# EAGLE board proto4 (EAGLE 6.6.0), part 1 of 5
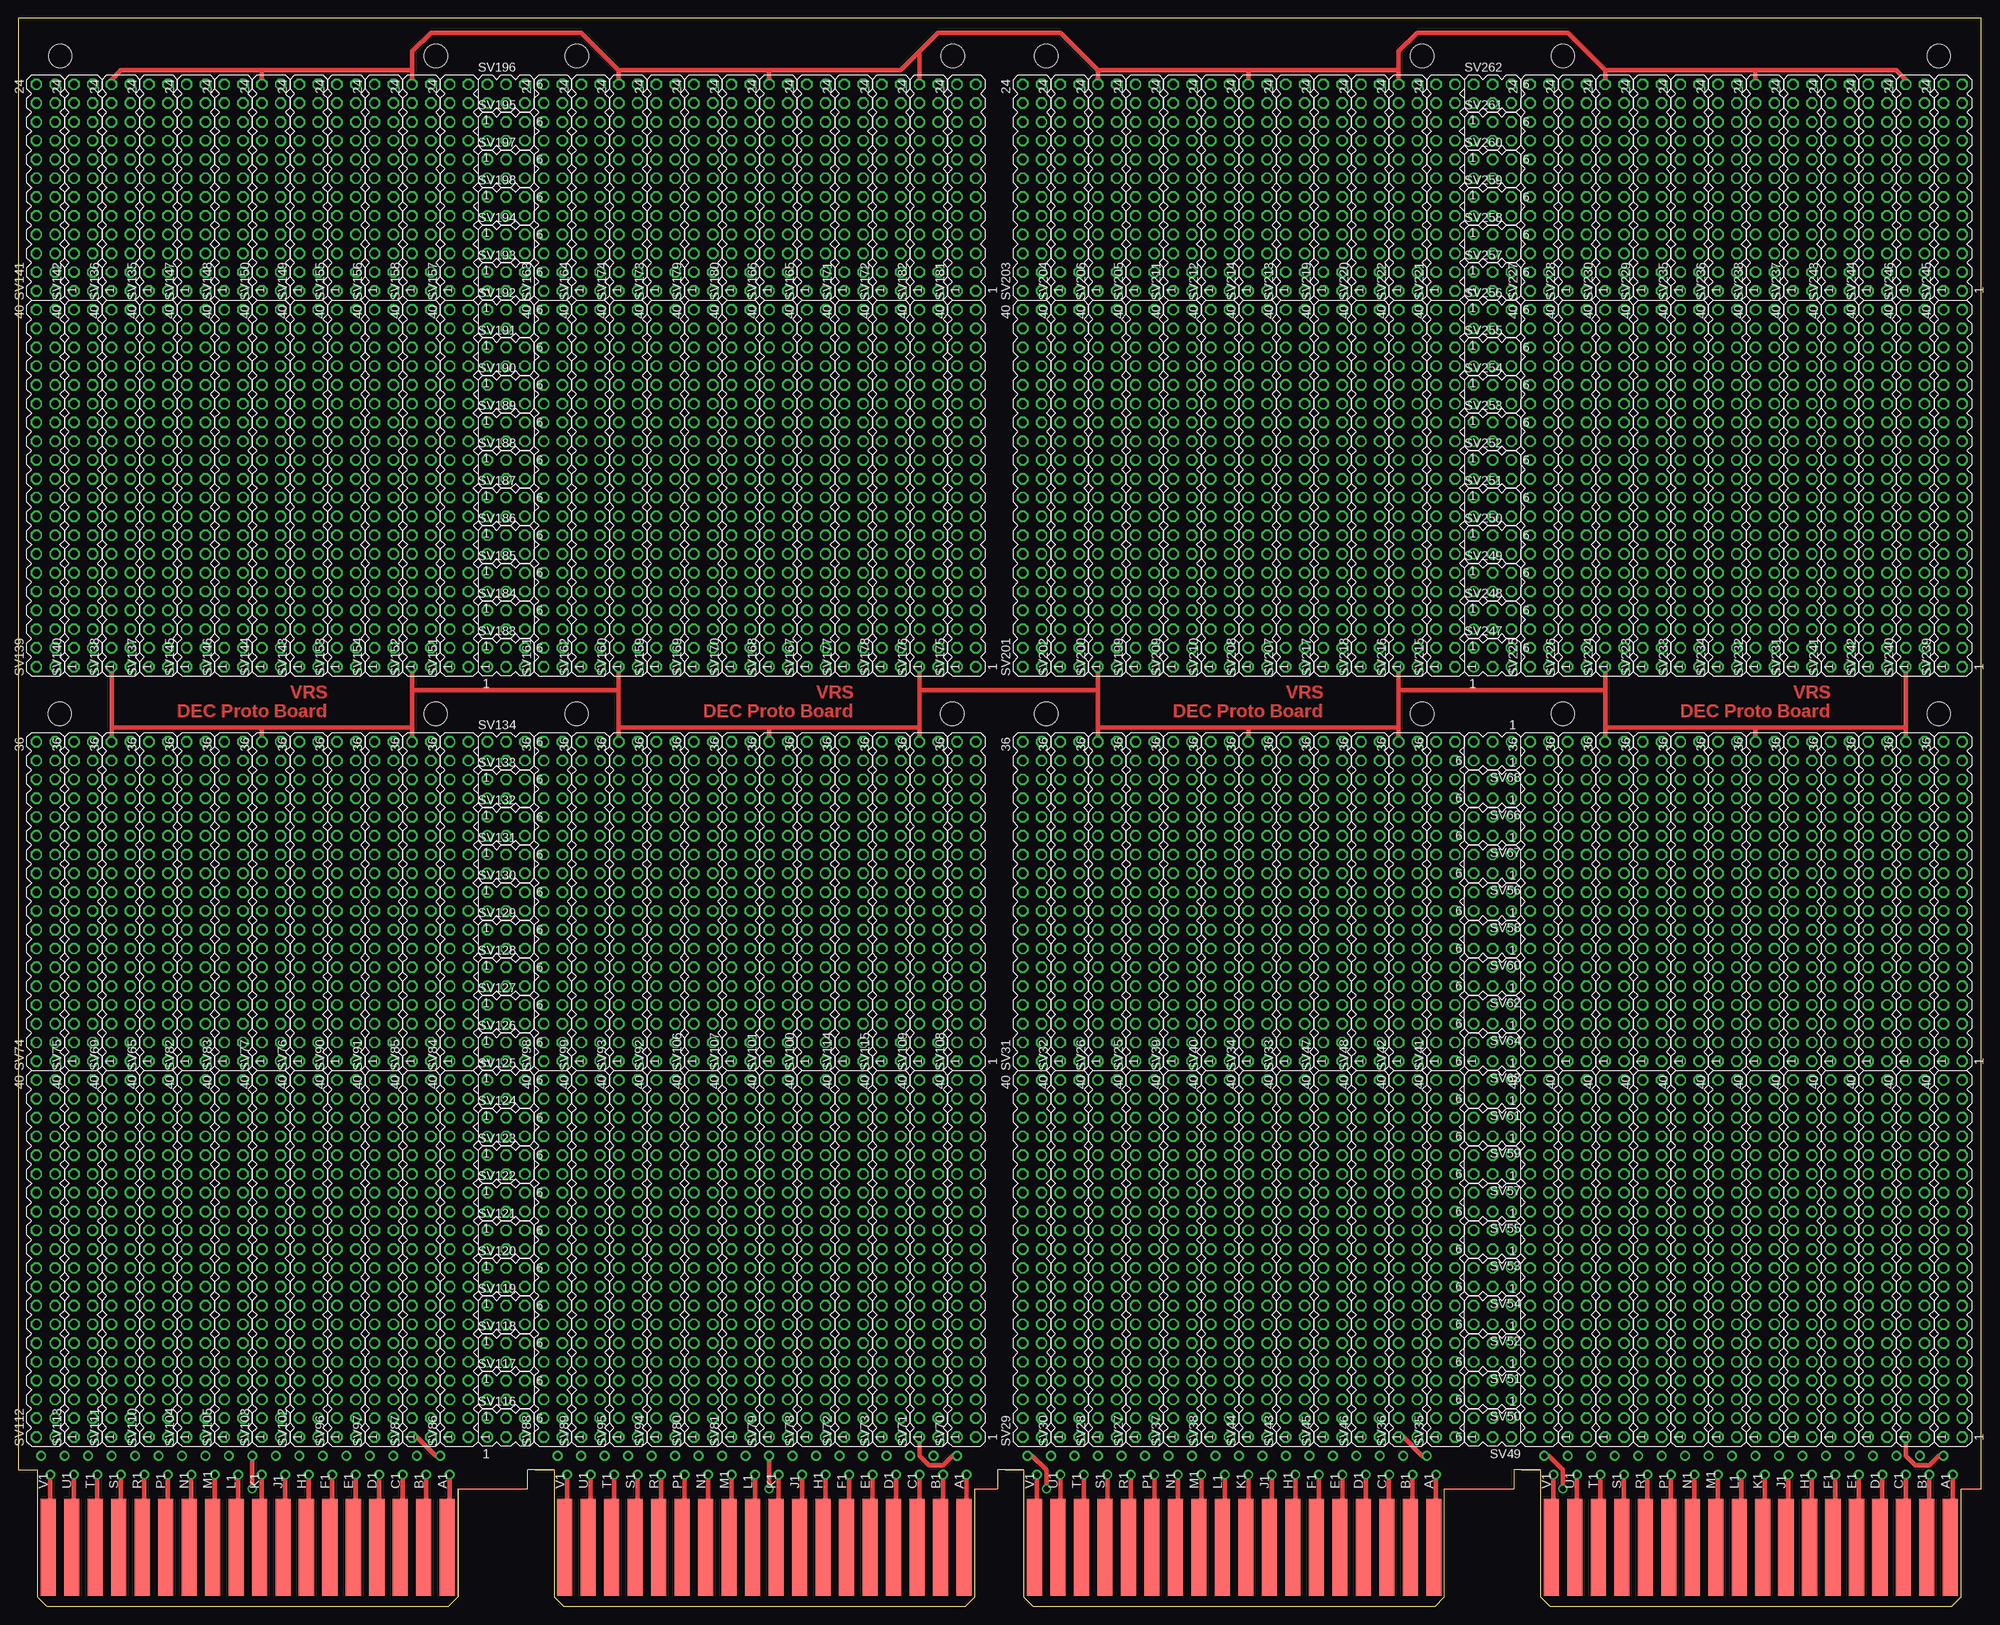
[diagram p5: board, top side]
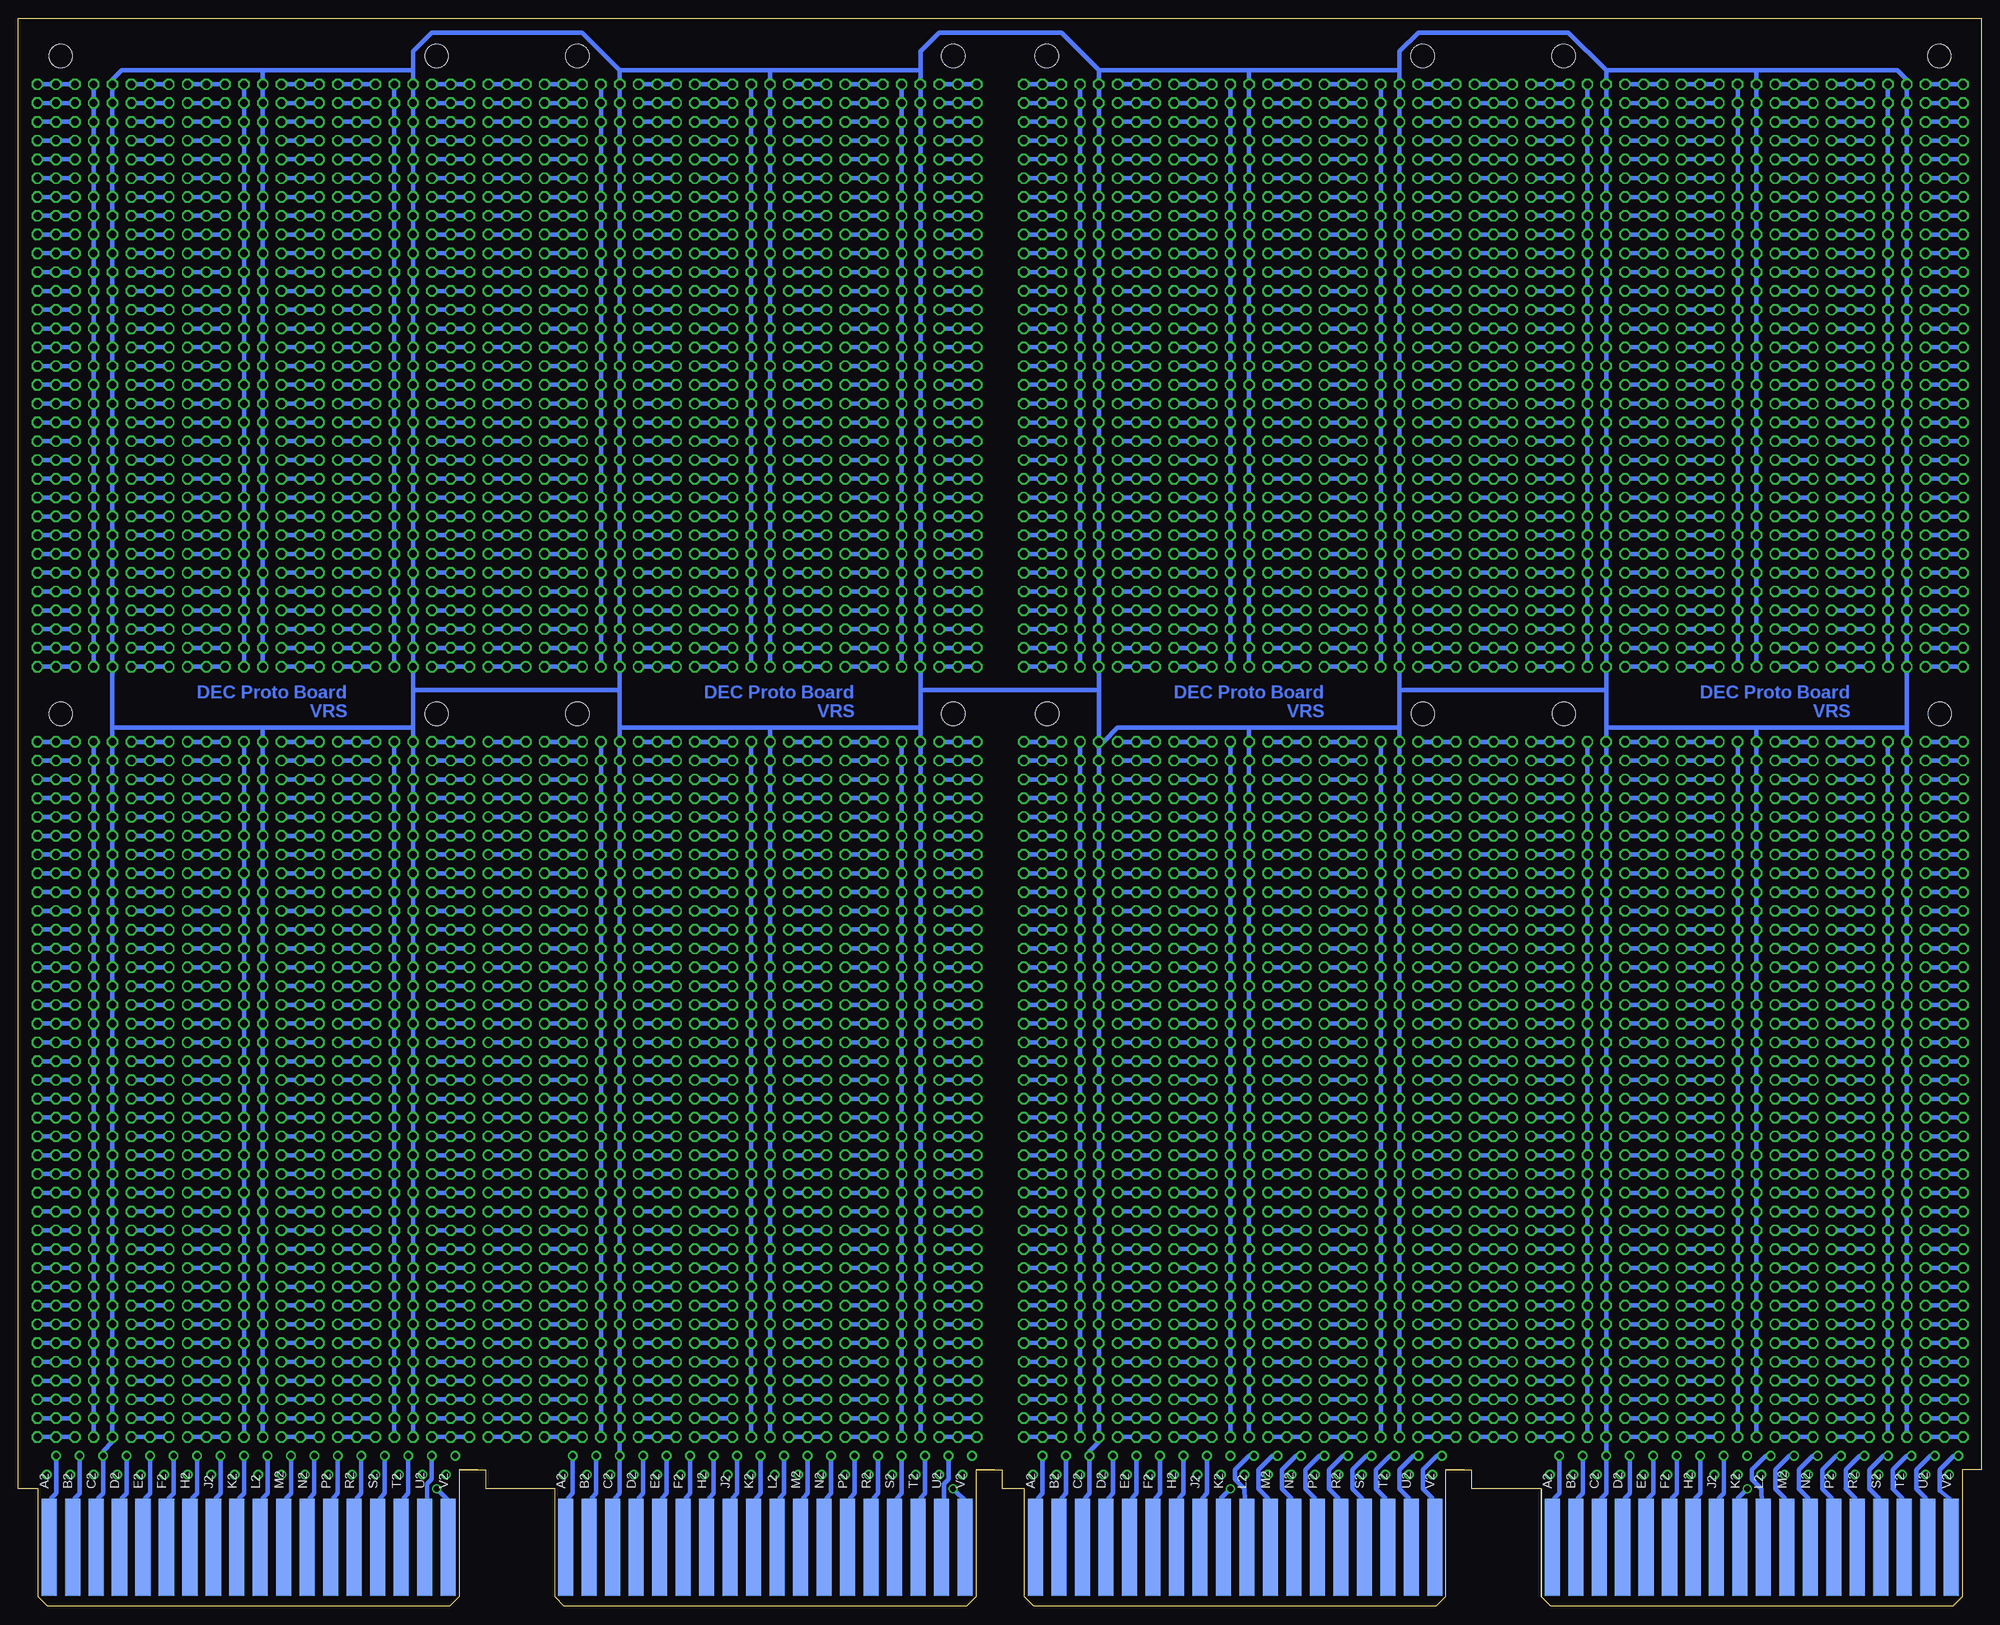
[diagram p6: board, bottom side, seen from below]

Size 265.3 x 214.63 mm. Coordinates in mm from the lower left corner, seen from the top.
Copper layers (1+16): Top 0.035mm / dielectric 1.5mm / Bottom 0.035mm
Design rules "16mils": minimum track width 16mil, minimum drill 32mil, track to track 15mil, track to pad 10mil, pad to pad 10mil, via to via 10mil, smd to smd 10mil, copper to edge 13mil, drill to drill 10mil, minimum pad ring 10mil, minimum via ring 8mil, stop-mask expansion 0mil, vias tented up to drill 0mil, thermal gap 10mil
Net classes: 0 default: width 0.635 mm
Holes 3.17 mm at 5.59,120.65 75.44,120.65 56.39,120.65 126.24,120.65 138.94,120.65 208.79,120.65 189.74,120.65 259.59,120.65

## Footprints (pad centres in the part's own frame; a part is rotated, then mirrored left to right if it is on the bottom)
EDGE-CON2 = smd 13.106 x 2.032: A1 7.938,4.128; B1 7.938,7.303; C1 7.938,10.477; D1 7.938,13.652; E1 7.938,16.828; F1 7.938,20.003; H1 7.938,23.177; J1 7.938,26.352; K1 7.938,29.527; L1 7.938,32.703; M1 7.938,35.877; N1 7.938,39.053; P1 7.938,42.227; R1 7.938,45.403; S1 7.938,48.578; T1 7.938,51.752; U1 7.938,54.928; V1 7.938,58.102 | smd 13.106 x 2.032 bottom: A2 7.938,4.128; B2 7.938,7.303; C2 7.938,10.477; D2 7.938,13.652; E2 7.938,16.828; F2 7.938,20.003; H2 7.938,23.177; J2 7.938,26.352; K2 7.938,29.527; L2 7.938,32.703; M2 7.938,35.877; N2 7.938,39.053; P2 7.938,42.227; R2 7.938,45.403; S2 7.938,48.578; T2 7.938,51.752; U2 7.938,54.928; V2 7.938,58.102
MA20-2 = drill 1.016 octagon: 1 -24.13,-1.27; 2 -24.13,1.27; 3 -21.59,-1.27; 4 -21.59,1.27; 5 -19.05,-1.27; 6 -19.05,1.27; 7 -16.51,-1.27; 8 -16.51,1.27; 9 -13.97,-1.27; 10 -13.97,1.27; 11 -11.43,-1.27; 12 -11.43,1.27; 13 -8.89,-1.27; 14 -8.89,1.27; 15 -6.35,-1.27; 16 -6.35,1.27; 17 -3.81,-1.27; 18 -3.81,1.27; 19 -1.27,-1.27; 20 -1.27,1.27; 21 1.27,-1.27; 22 1.27,1.27; 23 3.81,-1.27; 24 3.81,1.27; 25 6.35,-1.27; 26 6.35,1.27; 27 8.89,-1.27; 28 8.89,1.27; 29 11.43,-1.27; 30 11.43,1.27; 31 13.97,-1.27; 32 13.97,1.27; 33 16.51,-1.27; 34 16.51,1.27; 35 19.05,-1.27; 36 19.05,1.27; 37 21.59,-1.27; 38 21.59,1.27; 39 24.13,-1.27; 40 24.13,1.27
MA18-2 = drill 1.016 octagon: 1 -21.59,-1.27; 2 -21.59,1.27; 3 -19.05,-1.27; 4 -19.05,1.27; 5 -16.51,-1.27; 6 -16.51,1.27; 7 -13.97,-1.27; 8 -13.97,1.27; 9 -11.43,-1.27; 10 -11.43,1.27; 11 -8.89,-1.27; 12 -8.89,1.27; 13 -6.35,-1.27; 14 -6.35,1.27; 15 -3.81,-1.27; 16 -3.81,1.27; 17 -1.27,-1.27; 18 -1.27,1.27; 19 1.27,-1.27; 20 1.27,1.27; 21 3.81,-1.27; 22 3.81,1.27; 23 6.35,-1.27; 24 6.35,1.27; 25 8.89,-1.27; 26 8.89,1.27; 27 11.43,-1.27; 28 11.43,1.27; 29 13.97,-1.27; 30 13.97,1.27; 31 16.51,-1.27; 32 16.51,1.27; 33 19.05,-1.27; 34 19.05,1.27; 35 21.59,-1.27; 36 21.59,1.27
MA03-2 = drill 1.016: 1 -2.54,-1.27 | drill 1.016 octagon: 2 -2.54,1.27; 3 0,-1.27; 4 0,1.27; 5 2.54,-1.27; 6 2.54,1.27
MA12-2 = drill 1.016 octagon: 1 -13.97,-1.27; 2 -13.97,1.27; 3 -11.43,-1.27; 4 -11.43,1.27; 5 -8.89,-1.27; 6 -8.89,1.27; 7 -6.35,-1.27; 8 -6.35,1.27; 9 -3.81,-1.27; 10 -3.81,1.27; 11 -1.27,-1.27; 12 -1.27,1.27; 13 1.27,-1.27; 14 1.27,1.27; 15 3.81,-1.27; 16 3.81,1.27; 17 6.35,-1.27; 18 6.35,1.27; 19 8.89,-1.27; 20 8.89,1.27; 21 11.43,-1.27; 22 11.43,1.27; 23 13.97,-1.27; 24 13.97,1.27
THRU-HOLEA = drill 0.813 pad 1.27: A1 17.78,3.81; A2 20.32,5.08; B1 17.78,6.985; B2 20.32,8.255; C1 17.78,10.16; C2 20.32,11.43; D1 17.78,13.335; D2 20.32,14.605; E1 17.78,16.51; E2 20.32,17.78; F1 17.78,19.685; F2 20.32,20.955; H1 17.78,22.86; H2 20.32,24.13; J1 17.78,26.035; J2 20.32,27.305; K1 17.78,29.21; K2 20.32,30.48; L1 17.78,32.385; L2 20.32,33.655; M1 17.78,35.56; M2 20.32,36.83; N1 17.78,38.735; N2 20.32,40.005; P1 17.78,41.91; P2 20.32,43.18; R1 17.78,45.085; R2 20.32,46.355; S1 17.78,48.26; S2 20.32,49.53; T1 17.78,51.435; T2 20.32,52.705; U1 17.78,54.61; U2 20.32,55.88; V1 17.78,57.785; V2 20.32,59.055
OMNIBUS = hole 3.175: 208.915,209.55; 259.715,209.55; 189.865,209.55; 139.065,209.55; 75.616,209.55; 126.416,209.55; 56.566,209.55; 5.766,209.55

## Placement (x,y rotation side)
A  [EDGE-CON2]  265.3,0 90 top
A1  [EDGE-CON2]  131.95,0 90 top
B  [EDGE-CON2]  195.45,0 90 top
B1  [EDGE-CON2]  62.1,0 90 top
SV1  [MA20-2]  261.49,46.99 90 top
SV2  [MA20-2]  256.41,46.99 90 top
SV3  [MA20-2]  246.25,46.99 90 top
SV4  [MA20-2]  251.33,46.99 90 top
SV5  [MA18-2]  246.25,95.25 90 top
SV6  [MA18-2]  251.33,95.25 90 top
SV7  [MA18-2]  261.49,95.25 90 top
SV8  [MA18-2]  256.41,95.25 90 top
SV9  [MA18-2]  241.17,95.25 90 top
SV10  [MA18-2]  236.09,95.25 90 top
SV11  [MA20-2]  241.17,46.99 90 top
SV12  [MA20-2]  236.09,46.99 90 top
SV13  [MA20-2]  225.93,46.99 90 top
SV14  [MA20-2]  231.01,46.99 90 top
SV15  [MA18-2]  225.93,95.25 90 top
SV16  [MA18-2]  231.01,95.25 90 top
SV17  [MA18-2]  220.85,95.25 90 top
SV18  [MA18-2]  215.77,95.25 90 top
SV19  [MA20-2]  220.85,46.99 90 top
SV20  [MA20-2]  215.77,46.99 90 top
SV21  [MA20-2]  205.61,46.99 90 top
SV22  [MA20-2]  210.69,46.99 90 top
SV23  [MA18-2]  205.61,95.25 90 top
SV24  [MA18-2]  210.69,95.25 90 top
SV25  [MA18-2]  152.27,95.25 90 top
SV26  [MA18-2]  147.19,95.25 90 top
SV27  [MA20-2]  152.27,46.99 90 top
SV28  [MA20-2]  147.19,46.99 90 top
SV29  [MA20-2]  137.03,46.99 90 top
SV30  [MA20-2]  142.11,46.99 90 top
SV31  [MA18-2]  137.03,95.25 90 top
SV32  [MA18-2]  142.11,95.25 90 top
SV33  [MA18-2]  172.59,95.25 90 top
SV34  [MA18-2]  167.51,95.25 90 top
SV35  [MA20-2]  192.91,46.99 90 top
SV36  [MA20-2]  187.83,46.99 90 top
SV37  [MA20-2]  157.35,46.99 90 top
SV38  [MA20-2]  162.43,46.99 90 top
SV39  [MA18-2]  157.35,95.25 90 top
SV40  [MA18-2]  162.43,95.25 90 top
SV41  [MA18-2]  192.91,95.25 90 top
SV42  [MA18-2]  187.83,95.25 90 top
SV43  [MA20-2]  172.59,46.99 90 top
SV44  [MA20-2]  167.51,46.99 90 top
SV45  [MA20-2]  177.67,46.99 90 top
SV46  [MA20-2]  182.75,46.99 90 top
SV47  [MA18-2]  177.67,95.25 90 top
SV48  [MA18-2]  182.75,95.25 90 top
SV49  [MA03-2]  199.26,24.13 180 top
SV50  [MA03-2]  199.26,29.21 180 top
SV51  [MA03-2]  199.26,34.29 180 top
SV52  [MA03-2]  199.26,39.37 180 top
SV53  [MA03-2]  199.26,49.53 180 top
SV54  [MA03-2]  199.26,44.45 180 top
SV55  [MA03-2]  199.26,54.61 180 top
SV56  [MA03-2]  199.26,100.33 180 top
SV57  [MA03-2]  199.26,59.69 180 top
SV58  [MA03-2]  199.26,95.25 180 top
SV59  [MA03-2]  199.26,64.77 180 top
SV60  [MA03-2]  199.26,90.17 180 top
SV61  [MA03-2]  199.26,69.85 180 top
SV62  [MA03-2]  199.26,85.09 180 top
SV63  [MA03-2]  199.26,74.93 180 top
SV64  [MA03-2]  199.26,80.01 180 top
SV65  [MA18-2]  18.92,95.25 90 top
SV66  [MA03-2]  199.26,110.49 180 top
SV67  [MA03-2]  199.26,105.41 180 top
SV68  [MA03-2]  199.26,115.57 180 top
SV69  [MA18-2]  13.84,95.25 90 top
SV70  [MA20-2]  128.14,46.99 90 top
SV71  [MA20-2]  123.06,46.99 90 top
SV72  [MA20-2]  112.9,46.99 90 top
SV73  [MA20-2]  117.98,46.99 90 top
SV74  [MA18-2]  3.68,95.25 90 top
SV75  [MA18-2]  8.76,95.25 90 top
SV76  [MA18-2]  39.24,95.25 90 top
SV77  [MA18-2]  34.16,95.25 90 top
SV78  [MA20-2]  107.82,46.99 90 top
SV79  [MA20-2]  102.74,46.99 90 top
SV80  [MA20-2]  92.58,46.99 90 top
SV81  [MA20-2]  97.66,46.99 90 top
SV82  [MA18-2]  24,95.25 90 top
SV83  [MA18-2]  29.08,95.25 90 top
SV84  [MA18-2]  59.56,95.25 90 top
SV85  [MA18-2]  54.48,95.25 90 top
SV86  [MA20-2]  59.56,46.99 90 top
SV87  [MA20-2]  54.48,46.99 90 top
SV88  [MA20-2]  72.26,46.99 90 top
SV89  [MA20-2]  77.34,46.99 90 top
SV90  [MA18-2]  44.32,95.25 90 top
SV91  [MA18-2]  49.4,95.25 90 top
SV92  [MA18-2]  87.5,95.25 90 top
SV93  [MA18-2]  82.42,95.25 90 top
SV94  [MA20-2]  87.5,46.99 90 top
SV95  [MA20-2]  82.42,46.99 90 top
SV96  [MA20-2]  44.32,46.99 90 top
SV97  [MA20-2]  49.4,46.99 90 top
SV98  [MA18-2]  72.26,95.25 90 top
SV99  [MA18-2]  77.34,95.25 90 top
SV100  [MA18-2]  107.82,95.25 90 top
SV101  [MA18-2]  102.74,95.25 90 top
SV102  [MA20-2]  39.24,46.99 90 top
SV103  [MA20-2]  34.16,46.99 90 top
SV104  [MA20-2]  24,46.99 90 top
SV105  [MA20-2]  29.08,46.99 90 top
SV106  [MA18-2]  92.58,95.25 90 top
SV107  [MA18-2]  97.66,95.25 90 top
SV108  [MA18-2]  128.14,95.25 90 top
SV109  [MA18-2]  123.06,95.25 90 top
SV110  [MA20-2]  18.92,46.99 90 top
SV111  [MA20-2]  13.84,46.99 90 top
SV112  [MA20-2]  3.68,46.99 90 top
SV113  [MA20-2]  8.76,46.99 90 top
SV114  [MA18-2]  112.9,95.25 90 top
SV115  [MA18-2]  117.98,95.25 90 top
SV116  [MA03-2]  65.91,24.13 0 top
SV117  [MA03-2]  65.91,29.21 0 top
SV118  [MA03-2]  65.91,34.29 0 top
SV119  [MA03-2]  65.91,39.37 0 top
SV120  [MA03-2]  65.91,44.45 0 top
SV121  [MA03-2]  65.91,49.53 0 top
SV122  [MA03-2]  65.91,54.61 0 top
SV123  [MA03-2]  65.91,59.69 0 top
SV124  [MA03-2]  65.91,64.77 0 top
SV125  [MA03-2]  65.91,69.85 0 top
SV126  [MA03-2]  65.91,74.93 0 top
SV127  [MA03-2]  65.91,80.01 0 top
SV128  [MA03-2]  65.91,85.09 0 top
SV129  [MA03-2]  65.91,90.17 0 top
SV130  [MA03-2]  65.91,95.25 0 top
SV131  [MA03-2]  65.91,100.33 0 top
SV132  [MA03-2]  65.91,105.41 0 top
SV133  [MA03-2]  65.91,110.49 0 top
SV134  [MA03-2]  65.91,115.57 0 top
SV135  [MA12-2]  18.92,191.77 90 top
SV136  [MA12-2]  13.84,191.77 90 top
SV137  [MA20-2]  18.92,151.13 90 top
SV138  [MA20-2]  13.84,151.13 90 top
SV139  [MA20-2]  3.68,151.13 90 top
SV140  [MA20-2]  8.76,151.13 90 top
SV141  [MA12-2]  3.68,191.77 90 top
SV142  [MA12-2]  8.76,191.77 90 top
SV143  [MA20-2]  39.24,151.13 90 top
SV144  [MA20-2]  34.16,151.13 90 top
SV145  [MA20-2]  24,151.13 90 top
SV146  [MA20-2]  29.08,151.13 90 top
SV147  [MA12-2]  24,191.77 90 top
SV148  [MA12-2]  29.08,191.77 90 top
SV149  [MA12-2]  39.24,191.77 90 top
SV150  [MA12-2]  34.16,191.77 90 top
SV151  [MA20-2]  59.56,151.13 90 top
SV152  [MA20-2]  54.48,151.13 90 top
SV153  [MA20-2]  44.32,151.13 90 top
SV154  [MA20-2]  49.4,151.13 90 top
SV155  [MA12-2]  44.32,191.77 90 top
SV156  [MA12-2]  49.4,191.77 90 top
SV157  [MA12-2]  59.56,191.77 90 top
SV158  [MA12-2]  54.48,191.77 90 top
SV159  [MA20-2]  87.5,151.13 90 top
SV160  [MA20-2]  82.42,151.13 90 top
SV161  [MA20-2]  72.26,151.13 90 top
SV162  [MA20-2]  77.34,151.13 90 top
SV163  [MA12-2]  72.26,191.77 90 top
SV164  [MA12-2]  77.34,191.77 90 top
SV165  [MA12-2]  107.82,191.77 90 top
SV166  [MA12-2]  102.74,191.77 90 top
SV167  [MA20-2]  107.82,151.13 90 top
SV168  [MA20-2]  102.74,151.13 90 top
SV169  [MA20-2]  92.58,151.13 90 top
SV170  [MA20-2]  97.66,151.13 90 top
SV171  [MA12-2]  112.9,191.77 90 top
SV172  [MA12-2]  117.98,191.77 90 top
SV173  [MA12-2]  87.5,191.77 90 top
SV174  [MA12-2]  82.42,191.77 90 top
SV175  [MA20-2]  128.14,151.13 90 top
SV176  [MA20-2]  123.06,151.13 90 top
SV177  [MA20-2]  112.9,151.13 90 top
SV178  [MA20-2]  117.98,151.13 90 top
SV179  [MA12-2]  92.58,191.77 90 top
SV180  [MA12-2]  97.66,191.77 90 top
SV181  [MA12-2]  128.14,191.77 90 top
SV182  [MA12-2]  123.06,191.77 90 top
SV183  [MA03-2]  65.91,128.27 0 top
SV184  [MA03-2]  65.91,133.35 0 top
SV185  [MA03-2]  65.91,138.43 0 top
SV186  [MA03-2]  65.91,143.51 0 top
SV187  [MA03-2]  65.91,148.59 0 top
SV188  [MA03-2]  65.91,153.67 0 top
SV189  [MA03-2]  65.91,158.75 0 top
SV190  [MA03-2]  65.91,163.83 0 top
SV191  [MA03-2]  65.91,168.91 0 top
SV192  [MA03-2]  65.91,173.99 0 top
SV193  [MA03-2]  65.91,179.07 0 top
SV194  [MA03-2]  65.91,184.15 0 top
SV195  [MA03-2]  65.91,199.39 0 top
SV196  [MA03-2]  65.91,204.47 0 top
SV197  [MA03-2]  65.91,194.31 0 top
SV198  [MA03-2]  65.91,189.23 0 top
SV199  [MA20-2]  152.27,151.13 90 top
SV200  [MA20-2]  147.19,151.13 90 top
SV201  [MA20-2]  137.03,151.13 90 top
SV202  [MA20-2]  142.11,151.13 90 top
SV203  [MA12-2]  137.03,191.77 90 top
SV204  [MA12-2]  142.11,191.77 90 top
SV205  [MA12-2]  152.27,191.77 90 top
SV206  [MA12-2]  147.19,191.77 90 top
SV207  [MA20-2]  172.59,151.13 90 top
SV208  [MA20-2]  167.51,151.13 90 top
SV209  [MA20-2]  157.35,151.13 90 top
SV210  [MA20-2]  162.43,151.13 90 top
SV211  [MA12-2]  157.35,191.77 90 top
SV212  [MA12-2]  162.43,191.77 90 top
SV213  [MA12-2]  172.59,191.77 90 top
SV214  [MA12-2]  167.51,191.77 90 top
SV215  [MA20-2]  192.91,151.13 90 top
SV216  [MA20-2]  187.83,151.13 90 top
SV217  [MA20-2]  177.67,151.13 90 top
SV218  [MA20-2]  182.75,151.13 90 top
SV219  [MA12-2]  177.67,191.77 90 top
SV220  [MA12-2]  182.75,191.77 90 top
SV221  [MA12-2]  192.91,191.77 90 top
SV222  [MA12-2]  187.83,191.77 90 top
SV223  [MA20-2]  220.85,151.13 90 top
SV224  [MA20-2]  215.77,151.13 90 top
SV225  [MA20-2]  205.61,151.13 90 top
SV226  [MA20-2]  210.69,151.13 90 top
SV227  [MA12-2]  205.61,191.77 90 top
SV228  [MA12-2]  210.69,191.77 90 top
SV229  [MA12-2]  220.85,191.77 90 top
SV230  [MA12-2]  215.77,191.77 90 top
SV231  [MA20-2]  241.17,151.13 90 top
SV232  [MA20-2]  236.09,151.13 90 top
SV233  [MA20-2]  225.93,151.13 90 top
SV234  [MA20-2]  231.01,151.13 90 top
SV235  [MA12-2]  225.93,191.77 90 top
SV236  [MA12-2]  231.01,191.77 90 top
SV237  [MA12-2]  241.17,191.77 90 top
SV238  [MA12-2]  236.09,191.77 90 top
SV239  [MA20-2]  261.49,151.13 90 top
SV240  [MA20-2]  256.41,151.13 90 top
SV241  [MA20-2]  246.25,151.13 90 top
SV242  [MA20-2]  251.33,151.13 90 top
SV243  [MA12-2]  246.25,191.77 90 top
SV244  [MA12-2]  251.33,191.77 90 top
SV245  [MA12-2]  261.49,191.77 90 top
SV246  [MA12-2]  256.41,191.77 90 top
SV247  [MA03-2]  199.26,128.27 0 top
SV248  [MA03-2]  199.26,133.35 0 top
SV249  [MA03-2]  199.26,138.43 0 top
SV250  [MA03-2]  199.26,143.51 0 top
SV251  [MA03-2]  199.26,148.59 0 top
SV252  [MA03-2]  199.26,153.67 0 top
SV253  [MA03-2]  199.26,158.75 0 top
SV254  [MA03-2]  199.26,163.83 0 top
SV255  [MA03-2]  199.26,168.91 0 top
SV256  [MA03-2]  199.26,173.99 0 top
SV257  [MA03-2]  199.26,179.07 0 top
SV258  [MA03-2]  199.26,184.15 0 top
SV259  [MA03-2]  199.26,189.23 0 top
SV260  [MA03-2]  199.26,194.31 0 top
SV261  [MA03-2]  199.26,199.39 0 top
SV262  [MA03-2]  199.26,204.47 0 top
U$1  THRU-HOLE2A  [THRU-HOLEA]  131.95,0 90 top
U$3  THRU-HOLE2A  [THRU-HOLEA]  265.3,0 90 top
U$5  THRU-HOLE2A  [THRU-HOLEA]  195.45,0 90 top
U$6  THRU-HOLE2A  [THRU-HOLEA]  62.1,0 90 top
U$7  OUTLINE-OMNIBUS  [OMNIBUS]  -0.13,0 0 top

## Tracks (layer width: path | path; a pad name or v marks a point on that pad's centre or on a via)
GND
  Bottom 0.635: SV14.1 SV14.3 SV14.5 SV14.7 SV14.9 SV14.11 SV14.13 SV14.15 SV14.17 SV14.19 SV14.21 SV14.23 SV14.25 SV14.27 SV14.29 SV14.31 SV14.33 SV14.35 SV14.37 SV14.39 SV16.1 SV16.3 SV16.5 SV16.7 SV16.9 SV16.11 SV16.13 SV16.15 SV16.17 SV16.19 SV16.21 SV16.23 SV16.25 SV16.27 SV16.29 SV16.31 SV16.33 SV16.35 232.28,118.75 | A.C2 254.51,14.61 253.87,15.24 U$3.C2 253.87,20.95 252.6,22.23 SV4.1 SV4.3 SV4.5 SV4.7 SV4.9 SV4.11 SV4.13 SV4.15 SV4.17 SV4.19 SV4.21 SV4.23 SV4.25 SV4.27 SV4.29 SV4.31 SV4.33 SV4.35 SV4.37 SV4.39 SV6.1 SV6.3 SV6.5 SV6.7 SV6.9 SV6.11 SV6.13 SV6.15 SV6.17 SV6.19 SV6.21 SV6.23 SV6.25 SV6.27 SV6.29 SV6.31 SV6.33 SV6.35 252.6,118.75 | 232.28,118.75 252.6,118.75 | SV30.1 SV30.3 SV30.5 SV30.7 SV30.9 SV30.11 SV30.13 SV30.15 SV30.17 SV30.19 SV30.21 SV30.23 SV30.25 SV30.27 SV30.29 SV30.31 SV30.33 SV30.35 SV30.37 SV30.39 SV32.1 SV32.3 SV32.5 SV32.7 SV32.9 SV32.11 SV32.13 SV32.15 SV32.17 SV32.19 SV32.21 SV32.23 SV32.25 SV32.27 SV32.29 SV32.31 SV32.33 SV32.35 143.38,118.75 | SV38.1 SV38.3 SV38.5 SV38.7 SV38.9 SV38.11 SV38.13 SV38.15 SV38.17 SV38.19 SV38.21 SV38.23 SV38.25 SV38.27 SV38.29 SV38.31 SV38.33 SV38.35 SV38.37 SV38.39 SV40.1 SV40.3 SV40.5 SV40.7 SV40.9 SV40.11 SV40.13 SV40.15 SV40.17 SV40.19 SV40.21 SV40.23 SV40.25 SV40.27 SV40.29 SV40.31 SV40.33 SV40.35 163.7,118.75 | SV22.1 SV22.3 SV22.5 SV22.7 SV22.9 SV22.11 SV22.13 SV22.15 SV22.17 SV22.19 SV22.21 SV22.23 SV22.25 SV22.27 SV22.29 SV22.31 SV22.33 SV22.35 SV22.37 SV22.39 SV24.1 SV24.3 SV24.5 SV24.7 SV24.9 SV24.11 SV24.13 SV24.15 SV24.17 SV24.19 SV24.21 SV24.23 SV24.25 SV24.27 SV24.29 SV24.31 SV24.33 SV24.35 211.96,118.75
  Bottom 0.635: B.C2 184.66,14.61 184.02,15.24 U$5.C2 SV46.1 SV46.3 SV46.5 SV46.7 SV46.9 SV46.11 SV46.13 SV46.15 SV46.17 SV46.19 SV46.21 SV46.23 SV46.25 SV46.27 SV46.29 SV46.31 SV46.33 SV46.35 SV46.37 SV46.39 SV48.1 SV48.3 SV48.5 SV48.7 SV48.9 SV48.11 SV48.13 SV48.15 SV48.17 SV48.19 SV48.21 SV48.23 SV48.25 SV48.27 SV48.29 SV48.31 SV48.33 SV48.35 184.02,118.75 | 184.02,123.83 211.96,123.83 | 184.02,118.75 184.02,123.83 | 211.96,123.83 211.96,118.75 | 163.7,118.75 184.02,118.75 | 143.38,123.83 143.38,118.75 | 143.38,118.75 163.7,118.75 | 143.38,123.83 SV202.1 SV202.3 SV202.5 SV202.7 SV202.9 SV202.11 SV202.13 SV202.15 SV202.17 SV202.19 SV202.21 SV202.23 SV202.25 SV202.27 SV202.29 SV202.31 SV202.33 SV202.35 SV202.37 SV202.39 SV204.1 SV204.3 SV204.5 SV204.7 SV204.9 SV204.11 SV204.13 SV204.15 SV204.17 SV204.19 SV204.21 SV204.23 143.38,207.65 | 211.96,118.75 232.28,118.75 | SV113.1 SV113.3 SV113.5 SV113.7 SV113.9 SV113.11 SV113.13 SV113.15 SV113.17 SV113.19 SV113.21 SV113.23 SV113.25 SV113.27 SV113.29 SV113.31 SV113.33 SV113.35 SV113.37 SV113.39 SV75.1 SV75.3 SV75.5 SV75.7 SV75.9 SV75.11 SV75.13 SV75.15 SV75.17 SV75.19 SV75.21 SV75.23 SV75.25 SV75.27 SV75.29 SV75.31 SV75.33 SV75.35 10.03,118.75 | SV105.1 SV105.3 SV105.5 SV105.7 SV105.9 SV105.11 SV105.13 SV105.15 SV105.17 SV105.19 SV105.21 SV105.23 SV105.25 SV105.27 SV105.29 SV105.31 SV105.33 SV105.35 SV105.37 SV105.39 SV83.1 SV83.3 SV83.5 SV83.7 SV83.9 SV83.11 SV83.13 SV83.15 SV83.17 SV83.19 SV83.21 SV83.23 SV83.25 SV83.27 SV83.29 SV83.31 SV83.33 SV83.35 30.35,118.75 | 30.35,118.75 10.03,118.75
  Bottom 0.635: B1.C2 51.31,14.61 50.67,15.24 U$6.C2 SV97.1 SV97.3 SV97.5 SV97.7 SV97.9 SV97.11 SV97.13 SV97.15 SV97.17 SV97.19 SV97.21 SV97.23 SV97.25 SV97.27 SV97.29 SV97.31 SV97.33 SV97.35 SV97.37 SV97.39 SV91.1 SV91.3 SV91.5 SV91.7 SV91.9 SV91.11 SV91.13 SV91.15 SV91.17 SV91.19 SV91.21 SV91.23 SV91.25 SV91.27 SV91.29 SV91.31 SV91.33 SV91.35 50.67,118.75 | 50.67,118.75 30.35,118.75 | SV89.1 SV89.3 SV89.5 SV89.7 SV89.9 SV89.11 SV89.13 SV89.15 SV89.17 SV89.19 SV89.21 SV89.23 SV89.25 SV89.27 SV89.29 SV89.31 SV89.33 SV89.35 SV89.37 SV89.39 SV99.1 SV99.3 SV99.5 SV99.7 SV99.9 SV99.11 SV99.13 SV99.15 SV99.17 SV99.19 SV99.21 SV99.23 SV99.25 SV99.27 SV99.29 SV99.31 SV99.33 SV99.35 78.61,118.75 | SV81.1 SV81.3 SV81.5 SV81.7 SV81.9 SV81.11 SV81.13 SV81.15 SV81.17 SV81.19 SV81.21 SV81.23 SV81.25 SV81.27 SV81.29 SV81.31 SV81.33 SV81.35 SV81.37 SV81.39 SV107.1 SV107.3 SV107.5 SV107.7 SV107.9 SV107.11 SV107.13 SV107.15 SV107.17 SV107.19 SV107.21 SV107.23 SV107.25 SV107.27 SV107.29 SV107.31 SV107.33 SV107.35 98.93,118.75 | SV115.35 SV115.33 SV115.31 SV115.29 SV115.27 SV115.25 SV115.23 SV115.21 SV115.19 SV115.17 SV115.15 SV115.13 SV115.11 SV115.9 SV115.7 SV115.5 SV115.3 SV115.1 SV73.39 SV73.37 SV73.35 SV73.33 SV73.31 SV73.29 SV73.27 SV73.25 SV73.23 SV73.21 SV73.19 SV73.17 SV73.15 SV73.13 SV73.11 SV73.9 SV73.7 SV73.5 SV73.3 SV73.1 119.25,22.23 120.52,20.95 U$1.C2 120.52,15.24 121.16,14.61 A1.C2 | 98.93,118.75 116.71,118.75 118.62,116.84 SV115.35 | 78.61,123.83 50.67,123.83 | SV146.1 SV146.3 SV146.5 SV146.7 SV146.9 SV146.11 SV146.13 SV146.15 SV146.17 SV146.19 SV146.21 SV146.23 SV146.25 SV146.27 SV146.29 SV146.31 SV146.33 SV146.35 SV146.37 SV146.39 SV148.1 SV148.3 SV148.5 SV148.7 SV148.9 SV148.11 SV148.13 SV148.15 SV148.17 SV148.19 SV148.21 SV148.23 30.35,207.65
  Bottom 0.635: 30.35,207.65 11.3,207.65 10.03,206.38 SV142.23 SV142.21 SV142.19 SV142.17 SV142.15 SV142.13 SV142.11 SV142.9 SV142.7 SV142.5 SV142.3 SV142.1 SV140.39 SV140.37 SV140.35 SV140.33 SV140.31 SV140.29 SV140.27 SV140.25 SV140.23 SV140.21 SV140.19 SV140.17 SV140.15 SV140.13 SV140.11 SV140.9 SV140.7 SV140.5 SV140.3 SV140.1 10.03,118.75 | 50.67,207.65 30.35,207.65 | 50.67,207.65 SV156.23 SV156.21 SV156.19 SV156.17 SV156.15 SV156.13 SV156.11 SV156.9 SV156.7 SV156.5 SV156.3 SV156.1 SV154.39 SV154.37 SV154.35 SV154.33 SV154.31 SV154.29 SV154.27 SV154.25 SV154.23 SV154.21 SV154.19 SV154.17 SV154.15 SV154.13 SV154.11 SV154.9 SV154.7 SV154.5 SV154.3 SV154.1 50.67,123.83 | SV234.1 SV234.3 SV234.5 SV234.7 SV234.9 SV234.11 SV234.13 SV234.15 SV234.17 SV234.19 SV234.21 SV234.23 SV234.25 SV234.27 SV234.29 SV234.31 SV234.33 SV234.35 SV234.37 SV234.39 SV236.1 SV236.3 SV236.5 SV236.7 SV236.9 SV236.11 SV236.13 SV236.15 SV236.17 SV236.19 SV236.21 SV236.23 232.28,207.65 | 211.96,207.65 232.28,207.65 | 232.28,207.65 251.33,207.65 252.6,206.38 SV244.23 SV244.21 SV244.19 SV244.17 SV244.15 SV244.13 SV244.11 SV244.9 SV244.7 SV244.5 SV244.3 SV244.1 SV242.39 SV242.37 SV242.35 SV242.33 SV242.31 SV242.29 SV242.27 SV242.25 SV242.23 SV242.21 SV242.19 SV242.17 SV242.15 SV242.13 SV242.11 SV242.9 SV242.7 SV242.5 SV242.3 SV242.1 252.6,118.75 | SV170.1 SV170.3 SV170.5 SV170.7 SV170.9 SV170.11 SV170.13 SV170.15 SV170.17 SV170.19 SV170.21 SV170.23 SV170.25 SV170.27 SV170.29 SV170.31 SV170.33 SV170.35 SV170.37 SV170.39 SV180.1 SV180.3 SV180.5 SV180.7 SV180.9 SV180.11 SV180.13 SV180.15 SV180.17 SV180.19 SV180.21 SV180.23 98.93,207.65
  Bottom 0.635: 98.93,207.65 78.61,207.65 | 78.61,207.65 SV164.23 SV164.21 SV164.19 SV164.17 SV164.15 SV164.13 SV164.11 SV164.9 SV164.7 SV164.5 SV164.3 SV164.1 SV162.39 SV162.37 SV162.35 SV162.33 SV162.31 SV162.29 SV162.27 SV162.25 SV162.23 SV162.21 SV162.19 SV162.17 SV162.15 SV162.13 SV162.11 SV162.9 SV162.7 SV162.5 SV162.3 SV162.1 78.61,123.83 | 119.25,207.65 98.93,207.65 | SV210.1 SV210.3 SV210.5 SV210.7 SV210.9 SV210.11 SV210.13 SV210.15 SV210.17 SV210.19 SV210.21 SV210.23 SV210.25 SV210.27 SV210.29 SV210.31 SV210.33 SV210.35 SV210.37 SV210.39 SV212.1 SV212.3 SV212.5 SV212.7 SV212.9 SV212.11 SV212.13 SV212.15 SV212.17 SV212.19 SV212.21 SV212.23 163.7,207.65 | 143.38,207.65 163.7,207.65 | 184.02,207.65 SV220.23 SV220.21 SV220.19 SV220.17 SV220.15 SV220.13 SV220.11 SV220.9 SV220.7 SV220.5 SV220.3 SV220.1 SV218.39 SV218.37 SV218.35 SV218.33 SV218.31 SV218.29 SV218.27 SV218.25 SV218.23 SV218.21 SV218.19 SV218.17 SV218.15 SV218.13 SV218.11 SV218.9 SV218.7 SV218.5 SV218.3 SV218.1 184.02,123.83 | 163.7,207.65 184.02,207.65 | 119.25,207.65 124.33,212.72 140.84,212.72 143.38,210.19 143.38,207.65 | 119.25,207.65 SV172.23 SV172.21 SV172.19 SV172.17 SV172.15 SV172.13 SV172.11 SV172.9 SV172.7 SV172.5 SV172.3 SV172.1 SV178.39 SV178.37 SV178.35 SV178.33 SV178.31 SV178.29 SV178.27 SV178.25 SV178.23 SV178.21 SV178.19 SV178.17 SV178.15 SV178.13 SV178.11 SV178.9 SV178.7 SV178.5 SV178.3 SV178.1 119.25,123.83 | 211.96,207.65 211.96,210.19 209.42,212.72 189.1,212.72 184.02,207.65 | 211.96,207.65 SV228.23 SV228.21 SV228.19 SV228.17 SV228.15 SV228.13 SV228.11 SV228.9 SV228.7 SV228.5 SV228.3 SV228.1 SV226.39 SV226.37 SV226.35 SV226.33 SV226.31 SV226.29 SV226.27 SV226.25 SV226.23 SV226.21 SV226.19 SV226.17 SV226.15 SV226.13 SV226.11 SV226.9 SV226.7 SV226.5 SV226.3 SV226.1 211.96,123.83
  Bottom 0.635: 50.67,207.65 55.75,212.72 76.07,212.72 78.61,210.19 78.61,207.65 | 78.61,118.75 78.61,123.83 | 98.93,118.75 78.61,118.75 | 119.25,123.83 143.38,123.83 | 50.67,123.83 50.67,118.75 | 119.25,123.83 SV115.35
N$1
  Bottom 0.635: U$3.K2 234.82,15.24 235.46,14.61 A.K2
N$2
  Bottom 0.635: U$3.J2 238,15.24 238.63,14.61 A.J2
N$3
  Bottom 0.635: U$3.H2 241.17,15.24 241.81,14.61 A.H2
N$4
  Bottom 0.635: U$3.L2 231.65,15.24 232.28,14.61 A.L2
N$5
  Bottom 0.635: U$3.M2 228.47,15.24 229.11,14.61 A.M2
N$6
  Bottom 0.635: U$3.N2 225.3,15.24 225.93,14.61 A.N2
N$7
  Bottom 0.635: U$3.P2 222.12,15.24 222.76,14.61 A.P2
N$8
  Bottom 0.635: U$3.F2 244.35,15.24 244.98,14.61 A.F2
N$9
  Bottom 0.635: U$3.E2 247.52,15.24 248.16,14.61 A.E2
N$10
  Bottom 0.635: U$3.D2 250.7,15.24 251.33,14.61 A.D2
N$11
  Bottom 0.635: SV1.1 262.13,22.86 260.86,22.86 SV1.2 259.59,22.86 258.32,22.86 SV2.1
N$12
  Bottom 0.635: U$3.R2 218.95,15.24 219.58,14.61 A.R2
N$13
  Bottom 0.635: U$3.S2 215.77,15.24 216.41,14.61 A.S2
N$14
  Bottom 0.635: U$3.B2 257.05,15.24 257.68,14.61 A.B2
N$15
  Bottom 0.635: SV1.3 262.13,25.4 260.86,25.4 SV1.4 259.59,25.4 258.32,25.4 SV2.3
N$16
  Bottom 0.635: U$3.T2 212.6,15.24 213.23,14.61 A.T2
N$17
  Bottom 0.635: U$3.U2 209.42,19.68 209.42,17.14 210.06,16.51 210.06,13.97 A.U2
N$18  (via drill 0.81)
  Top 0.635: v208.79,15.88 208.79,18.41 206.88,20.32 U$3.V2
  Bottom 0.635: v208.79,15.88 206.88,13.97 A.V2
N$19
  Top 0.635: U$3.A1 261.49,17.14 261.49,13.97 A.A1
N$20
  Top 0.635: U$3.V1 207.52,17.14 207.52,13.97 A.V1
N$21
  Top 0.635: U$3.U1 210.69,17.14 210.69,13.97 A.U1
N$22
  Top 0.635: U$3.T1 213.87,15.24 A.T1
N$23
  Top 0.635: U$3.S1 217.04,15.24 A.S1
N$24
  Top 0.635: U$3.R1 220.22,15.24 A.R1
N$25
  Top 0.635: U$3.P1 223.39,15.24 A.P1
N$26
  Top 0.635: U$3.N1 226.57,15.24 A.N1
N$27
  Top 0.635: U$3.M1 229.74,15.24 A.M1
N$28
  Top 0.635: U$3.L1 232.92,15.24 A.L1
N$29
  Top 0.635: U$3.K1 236.09,15.24 A.K1
N$30
  Top 0.635: U$3.J1 239.27,15.24 A.J1
N$31
  Top 0.635: U$3.H1 242.44,15.24 A.H1
N$32
  Top 0.635: U$3.F1 245.62,15.24 A.F1
N$33
  Top 0.635: U$3.E1 248.79,15.24 A.E1
N$34
  Top 0.635: U$3.D1 251.97,15.24 A.D1
N$35
  Top 0.635: U$3.C1 255.14,15.24 A.C1
N$36
  Top 0.635: U$3.B1 258.32,15.24 A.B1
N$37
  Bottom 0.635: SV1.5 262.13,27.94 260.86,27.94 SV1.6 259.59,27.94 258.32,27.94 SV2.5
N$38
  Bottom 0.635: SV7.1 262.13,73.66 260.86,73.66 SV7.2 259.59,73.66 258.32,73.66 SV8.1
N$39
  Bottom 0.635: SV7.3 262.13,76.2 260.86,76.2 SV7.4 259.59,76.2 258.32,76.2 SV8.3
N$40
  Bottom 0.635: SV7.5 262.13,78.74 260.86,78.74 SV7.6 259.59,78.74 258.32,78.74 SV8.5
N$41
  Bottom 0.635: SV7.7 262.13,81.28 260.86,81.28 SV7.8 259.59,81.28 258.32,81.28 SV8.7
N$42
  Bottom 0.635: SV7.9 262.13,83.82 260.86,83.82 SV7.10 259.59,83.82 258.32,83.82 SV8.9
N$43
  Bottom 0.635: SV7.11 262.13,86.36 260.86,86.36 SV7.12 259.59,86.36 258.32,86.36 SV8.11
N$44
  Bottom 0.635: SV7.13 262.13,88.9 260.86,88.9 SV7.14 259.59,88.9 258.32,88.9 SV8.13
N$45
  Bottom 0.635: SV1.7 262.13,30.48 260.86,30.48 SV1.8 259.59,30.48 258.32,30.48 SV2.7
N$46
  Bottom 0.635: SV1.9 262.13,33.02 260.86,33.02 SV1.10 259.59,33.02 258.32,33.02 SV2.9
N$47
  Bottom 0.635: SV1.11 262.13,35.56 260.86,35.56 SV1.12 259.59,35.56 258.32,35.56 SV2.11
N$48
  Bottom 0.635: SV1.13 262.13,38.1 260.86,38.1 SV1.14 259.59,38.1 258.32,38.1 SV2.13
N$49
  Bottom 0.635: SV1.15 262.13,40.64 260.86,40.64 SV1.16 259.59,40.64 258.32,40.64 SV2.15
N$50
  Bottom 0.635: SV1.17 262.13,43.18 260.86,43.18 SV1.18 259.59,43.18 258.32,43.18 SV2.17
N$51
  Bottom 0.635: SV1.19 262.13,45.72 260.86,45.72 SV1.20 259.59,45.72 258.32,45.72 SV2.19
N$52
  Bottom 0.635: SV1.21 262.13,48.26 260.86,48.26 SV1.22 259.59,48.26 258.32,48.26 SV2.21
N$53
  Bottom 0.635: SV1.23 262.13,50.8 260.86,50.8 SV1.24 259.59,50.8 258.32,50.8 SV2.23
N$54
  Bottom 0.635: SV1.25 262.13,53.34 260.86,53.34 SV1.26 259.59,53.34 258.32,53.34 SV2.25
N$55
  Bottom 0.635: SV1.27 262.13,55.88 260.86,55.88 SV1.28 259.59,55.88 258.32,55.88 SV2.27
N$56
  Bottom 0.635: SV1.29 262.13,58.42 260.86,58.42 SV1.30 259.59,58.42 258.32,58.42 SV2.29
N$57
  Bottom 0.635: SV1.31 262.13,60.96 260.86,60.96 SV1.32 259.59,60.96 258.32,60.96 SV2.31
N$58
  Bottom 0.635: SV1.33 262.13,63.5 260.86,63.5 SV1.34 259.59,63.5 258.32,63.5 SV2.33
N$59
  Bottom 0.635: SV1.35 262.13,66.04 260.86,66.04 SV1.36 259.59,66.04 258.32,66.04 SV2.35
N$60
  Bottom 0.635: SV1.37 262.13,68.58 260.86,68.58 SV1.38 259.59,68.58 258.32,68.58 SV2.37
N$61
  Bottom 0.635: SV1.39 262.13,71.12 260.86,71.12 SV1.40 259.59,71.12 258.32,71.12 SV2.39
N$62
  Bottom 0.635: SV7.15 262.13,91.44 260.86,91.44 SV7.16 259.59,91.44 258.32,91.44 SV8.15
N$63
  Bottom 0.635: SV7.17 262.13,93.98 260.86,93.98 SV7.18 259.59,93.98 258.32,93.98 SV8.17
N$64
  Bottom 0.635: SV7.19 262.13,96.52 260.86,96.52 SV7.20 259.59,96.52 258.32,96.52 SV8.19
N$65
  Bottom 0.635: SV7.21 262.13,99.06 260.86,99.06 SV7.22 259.59,99.06 258.32,99.06 SV8.21
N$66
  Bottom 0.635: SV7.23 262.13,101.6 260.86,101.6 SV7.24 259.59,101.6 258.32,101.6 SV8.23
N$67
  Bottom 0.635: SV7.25 262.13,104.14 260.86,104.14 SV7.26 259.59,104.14 258.32,104.14 SV8.25
N$68
  Bottom 0.635: SV7.27 262.13,106.68 260.86,106.68 SV7.28 259.59,106.68 258.32,106.68 SV8.27
N$69
  Bottom 0.635: SV7.29 262.13,109.22 260.86,109.22 SV7.30 259.59,109.22 258.32,109.22 SV8.29
N$70
  Bottom 0.635: SV7.31 262.13,111.76 260.86,111.76 SV7.32 259.59,111.76 258.32,111.76 SV8.31
N$71
  Bottom 0.635: SV7.33 262.13,114.3 260.86,114.3 SV7.34 259.59,114.3 258.32,114.3 SV8.33
N$72
  Bottom 0.635: SV7.35 262.13,116.84 260.86,116.84 SV7.36 259.59,116.84 258.32,116.84 SV8.35
N$73
  Bottom 0.635: SV4.40 249.43,71.12 248.16,71.12 SV3.39 246.89,71.12 245.62,71.12 SV3.40
N$74
  Bottom 0.635: SV4.38 249.43,68.58 248.16,68.58 SV3.37 246.89,68.58 245.62,68.58 SV3.38
N$75
  Bottom 0.635: SV4.36 249.43,66.04 248.16,66.04 SV3.35 246.89,66.04 245.62,66.04 SV3.36
N$76
  Bottom 0.635: SV4.34 249.43,63.5 248.16,63.5 SV3.33 246.89,63.5 245.62,63.5 SV3.34
N$77
  Bottom 0.635: SV4.32 249.43,60.96 248.16,60.96 SV3.31 246.89,60.96 245.62,60.96 SV3.32
N$78
  Bottom 0.635: SV4.30 249.43,58.42 248.16,58.42 SV3.29 246.89,58.42 245.62,58.42 SV3.30
N$79
  Bottom 0.635: SV4.28 249.43,55.88 248.16,55.88 SV3.27 246.89,55.88 245.62,55.88 SV3.28
N$80
  Bottom 0.635: SV4.26 249.43,53.34 248.16,53.34 SV3.25 246.89,53.34 245.62,53.34 SV3.26
N$81
  Bottom 0.635: SV4.24 249.43,50.8 248.16,50.8 SV3.23 246.89,50.8 245.62,50.8 SV3.24
N$82
  Bottom 0.635: SV4.22 249.43,48.26 248.16,48.26 SV3.21 246.89,48.26 245.62,48.26 SV3.22
N$83
  Bottom 0.635: SV4.20 249.43,45.72 248.16,45.72 SV3.19 246.89,45.72 245.62,45.72 SV3.20
N$84
  Bottom 0.635: SV4.18 249.43,43.18 248.16,43.18 SV3.17 246.89,43.18 245.62,43.18 SV3.18
N$85
  Bottom 0.635: SV4.16 249.43,40.64 248.16,40.64 SV3.15 246.89,40.64 245.62,40.64 SV3.16
N$86
  Bottom 0.635: SV4.14 249.43,38.1 248.16,38.1 SV3.13 246.89,38.1 245.62,38.1 SV3.14
N$87
  Bottom 0.635: SV4.12 249.43,35.56 248.16,35.56 SV3.11 246.89,35.56 245.62,35.56 SV3.12
N$88
  Bottom 0.635: SV4.10 249.43,33.02 248.16,33.02 SV3.9 246.89,33.02 245.62,33.02 SV3.10
N$89
  Bottom 0.635: SV4.8 249.43,30.48 248.16,30.48 SV3.7 246.89,30.48 245.62,30.48 SV3.8
N$90
  Bottom 0.635: SV4.6 249.43,27.94 248.16,27.94 SV3.5 246.89,27.94 245.62,27.94 SV3.6
N$91
  Bottom 0.635: SV4.4 249.43,25.4 248.16,25.4 SV3.3 246.89,25.4 245.62,25.4 SV3.4
N$92
  Bottom 0.635: SV4.2 249.43,22.86 248.16,22.86 SV3.1 246.89,22.86 245.62,22.86 SV3.2
N$93
  Bottom 0.635: SV11.1 241.81,22.86 240.54,22.86 SV11.2 239.27,22.86 238,22.86 SV12.1
N$94
  Bottom 0.635: SV6.36 249.43,116.84 248.16,116.84 SV5.35 246.89,116.84 245.62,116.84 SV5.36
N$95
  Bottom 0.635: SV6.34 249.43,114.3 248.16,114.3 SV5.33 246.89,114.3 245.62,114.3 SV5.34
N$96
  Bottom 0.635: SV6.32 249.43,111.76 248.16,111.76 SV5.31 246.89,111.76 245.62,111.76 SV5.32
N$97
  Bottom 0.635: SV6.30 249.43,109.22 248.16,109.22 SV5.29 246.89,109.22 245.62,109.22 SV5.30
N$98
  Bottom 0.635: SV6.28 249.43,106.68 248.16,106.68 SV5.27 246.89,106.68 245.62,106.68 SV5.28
N$99
  Bottom 0.635: SV6.26 249.43,104.14 248.16,104.14 SV5.25 246.89,104.14 245.62,104.14 SV5.26
N$100
  Bottom 0.635: SV6.24 249.43,101.6 248.16,101.6 SV5.23 246.89,101.6 245.62,101.6 SV5.24
N$101
  Bottom 0.635: SV6.22 249.43,99.06 248.16,99.06 SV5.21 246.89,99.06 245.62,99.06 SV5.22
N$102
  Bottom 0.635: SV6.20 249.43,96.52 248.16,96.52 SV5.19 246.89,96.52 245.62,96.52 SV5.20
N$103
  Bottom 0.635: SV6.18 249.43,93.98 248.16,93.98 SV5.17 246.89,93.98 245.62,93.98 SV5.18
N$104
  Bottom 0.635: SV6.16 249.43,91.44 248.16,91.44 SV5.15 246.89,91.44 245.62,91.44 SV5.16
N$105
  Bottom 0.635: SV6.14 249.43,88.9 248.16,88.9 SV5.13 246.89,88.9 245.62,88.9 SV5.14
N$106
  Bottom 0.635: SV6.12 249.43,86.36 248.16,86.36 SV5.11 246.89,86.36 245.62,86.36 SV5.12
N$107
  Bottom 0.635: SV6.10 249.43,83.82 248.16,83.82 SV5.9 246.89,83.82 245.62,83.82 SV5.10
N$108
  Bottom 0.635: SV6.8 249.43,81.28 248.16,81.28 SV5.7 246.89,81.28 245.62,81.28 SV5.8
N$109
  Bottom 0.635: SV6.6 249.43,78.74 248.16,78.74 SV5.5 246.89,78.74 245.62,78.74 SV5.6
N$110
  Bottom 0.635: SV6.4 249.43,76.2 248.16,76.2 SV5.3 246.89,76.2 245.62,76.2 SV5.4
N$111
  Bottom 0.635: SV6.2 249.43,73.66 248.16,73.66 SV5.1 246.89,73.66 245.62,73.66 SV5.2
N$112
  Bottom 0.635: SV11.3 241.81,25.4 240.54,25.4 SV11.4 239.27,25.4 238,25.4 SV12.3
N$113
  Bottom 0.635: SV11.5 241.81,27.94 240.54,27.94 SV11.6 239.27,27.94 238,27.94 SV12.5
N$114
  Bottom 0.635: SV11.7 241.81,30.48 240.54,30.48 SV11.8 239.27,30.48 238,30.48 SV12.7
N$115
  Bottom 0.635: SV11.9 241.81,33.02 240.54,33.02 SV11.10 239.27,33.02 238,33.02 SV12.9
N$116
  Bottom 0.635: SV11.11 241.81,35.56 240.54,35.56 SV11.12 239.27,35.56 238,35.56 SV12.11
N$117
  Bottom 0.635: SV11.13 241.81,38.1 240.54,38.1 SV11.14 239.27,38.1 238,38.1 SV12.13
N$118
  Bottom 0.635: SV11.15 241.81,40.64 240.54,40.64 SV11.16 239.27,40.64 238,40.64 SV12.15
N$119
  Bottom 0.635: SV11.17 241.81,43.18 240.54,43.18 SV11.18 239.27,43.18 238,43.18 SV12.17
N$120
  Bottom 0.635: SV11.19 241.81,45.72 240.54,45.72 SV11.20 239.27,45.72 238,45.72 SV12.19
N$121
  Bottom 0.635: SV11.21 241.81,48.26 240.54,48.26 SV11.22 239.27,48.26 238,48.26 SV12.21
N$122
  Bottom 0.635: SV11.23 241.81,50.8 240.54,50.8 SV11.24 239.27,50.8 238,50.8 SV12.23
N$123
  Bottom 0.635: SV11.25 241.81,53.34 240.54,53.34 SV11.26 239.27,53.34 238,53.34 SV12.25
N$124
  Bottom 0.635: SV11.27 241.81,55.88 240.54,55.88 SV11.28 239.27,55.88 238,55.88 SV12.27
N$125
  Bottom 0.635: SV11.29 241.81,58.42 240.54,58.42 SV11.30 239.27,58.42 238,58.42 SV12.29
N$126
  Bottom 0.635: SV11.31 241.81,60.96 240.54,60.96 SV11.32 239.27,60.96 238,60.96 SV12.31
N$127
  Bottom 0.635: SV11.33 241.81,63.5 240.54,63.5 SV11.34 239.27,63.5 238,63.5 SV12.33
N$128
  Bottom 0.635: SV11.35 241.81,66.04 240.54,66.04 SV11.36 239.27,66.04 238,66.04 SV12.35
N$129
  Bottom 0.635: SV11.37 241.81,68.58 240.54,68.58 SV11.38 239.27,68.58 238,68.58 SV12.37
N$130
  Bottom 0.635: SV11.39 241.81,71.12 240.54,71.12 SV11.40 239.27,71.12 238,71.12 SV12.39
N$131
  Bottom 0.635: SV9.1 241.81,73.66 240.54,73.66 SV9.2 239.27,73.66 238,73.66 SV10.1
N$132
  Bottom 0.635: SV9.3 241.81,76.2 240.54,76.2 SV9.4 239.27,76.2 238,76.2 SV10.3
N$133
  Bottom 0.635: SV9.5 241.81,78.74 240.54,78.74 SV9.6 239.27,78.74 238,78.74 SV10.5
N$134
  Bottom 0.635: SV9.7 241.81,81.28 240.54,81.28 SV9.8 239.27,81.28 238,81.28 SV10.7
N$135
  Bottom 0.635: SV9.9 241.81,83.82 240.54,83.82 SV9.10 239.27,83.82 238,83.82 SV10.9
N$136
  Bottom 0.635: SV9.11 241.81,86.36 240.54,86.36 SV9.12 239.27,86.36 238,86.36 SV10.11
N$137
  Bottom 0.635: SV9.13 241.81,88.9 240.54,88.9 SV9.14 239.27,88.9 238,88.9 SV10.13
N$138
  Bottom 0.635: SV9.15 241.81,91.44 240.54,91.44 SV9.16 239.27,91.44 238,91.44 SV10.15
N$139
  Bottom 0.635: SV9.17 241.81,93.98 240.54,93.98 SV9.18 239.27,93.98 238,93.98 SV10.17
N$140
  Bottom 0.635: SV9.19 241.81,96.52 240.54,96.52 SV9.20 239.27,96.52 238,96.52 SV10.19
N$141
  Bottom 0.635: SV9.21 241.81,99.06 240.54,99.06 SV9.22 239.27,99.06 238,99.06 SV10.21
N$142
  Bottom 0.635: SV9.23 241.81,101.6 240.54,101.6 SV9.24 239.27,101.6 238,101.6 SV10.23
N$143
  Bottom 0.635: SV9.25 241.81,104.14 240.54,104.14 SV9.26 239.27,104.14 238,104.14 SV10.25
N$144
  Bottom 0.635: SV9.27 241.81,106.68 240.54,106.68 SV9.28 239.27,106.68 238,106.68 SV10.27
N$145
  Bottom 0.635: SV9.29 241.81,109.22 240.54,109.22 SV9.30 239.27,109.22 238,109.22 SV10.29
N$146
  Bottom 0.635: SV9.31 241.81,111.76 240.54,111.76 SV9.32 239.27,111.76 238,111.76 SV10.31
N$147
  Bottom 0.635: SV9.33 241.81,114.3 240.54,114.3 SV9.34 239.27,114.3 238,114.3 SV10.33
N$148
  Bottom 0.635: SV9.35 241.81,116.84 240.54,116.84 SV9.36 239.27,116.84 238,116.84 SV10.35
N$149
  Bottom 0.635: SV14.40 229.11,71.12 227.84,71.12 SV13.39 226.57,71.12 225.3,71.12 SV13.40
N$150
  Bottom 0.635: SV14.38 229.11,68.58 227.84,68.58 SV13.37 226.57,68.58 225.3,68.58 SV13.38
N$151
  Bottom 0.635: SV14.36 229.11,66.04 227.84,66.04 SV13.35 226.57,66.04 225.3,66.04 SV13.36
N$152
  Bottom 0.635: SV14.34 229.11,63.5 227.84,63.5 SV13.33 226.57,63.5 225.3,63.5 SV13.34
N$153
  Bottom 0.635: SV14.32 229.11,60.96 227.84,60.96 SV13.31 226.57,60.96 225.3,60.96 SV13.32
N$154
  Bottom 0.635: SV14.30 229.11,58.42 227.84,58.42 SV13.29 226.57,58.42 225.3,58.42 SV13.30
N$155
  Bottom 0.635: SV14.28 229.11,55.88 227.84,55.88 SV13.27 226.57,55.88 225.3,55.88 SV13.28
N$156
  Bottom 0.635: SV14.26 229.11,53.34 227.84,53.34 SV13.25 226.57,53.34 225.3,53.34 SV13.26
N$157
  Bottom 0.635: SV14.24 229.11,50.8 227.84,50.8 SV13.23 226.57,50.8 225.3,50.8 SV13.24
N$158
  Bottom 0.635: SV14.22 229.11,48.26 227.84,48.26 SV13.21 226.57,48.26 225.3,48.26 SV13.22
N$159
  Bottom 0.635: SV14.20 229.11,45.72 227.84,45.72 SV13.19 226.57,45.72 225.3,45.72 SV13.20
N$160
  Bottom 0.635: SV14.18 229.11,43.18 227.84,43.18 SV13.17 226.57,43.18 225.3,43.18 SV13.18
N$161
  Bottom 0.635: SV14.16 229.11,40.64 227.84,40.64 SV13.15 226.57,40.64 225.3,40.64 SV13.16
N$162
  Bottom 0.635: SV14.14 229.11,38.1 227.84,38.1 SV13.13 226.57,38.1 225.3,38.1 SV13.14
N$163
  Bottom 0.635: SV14.12 229.11,35.56 227.84,35.56 SV13.11 226.57,35.56 225.3,35.56 SV13.12
N$164
  Bottom 0.635: SV14.10 229.11,33.02 227.84,33.02 SV13.9 226.57,33.02 225.3,33.02 SV13.10
N$165
  Bottom 0.635: SV14.8 229.11,30.48 227.84,30.48 SV13.7 226.57,30.48 225.3,30.48 SV13.8
N$166
  Bottom 0.635: SV14.6 229.11,27.94 227.84,27.94 SV13.5 226.57,27.94 225.3,27.94 SV13.6
N$167
  Bottom 0.635: SV14.4 229.11,25.4 227.84,25.4 SV13.3 226.57,25.4 225.3,25.4 SV13.4
N$168
  Bottom 0.635: SV14.2 229.11,22.86 227.84,22.86 SV13.1 226.57,22.86 225.3,22.86 SV13.2
N$169
  Bottom 0.635: SV16.36 229.11,116.84 227.84,116.84 SV15.35 226.57,116.84 225.3,116.84 SV15.36
N$170
  Bottom 0.635: SV16.34 229.11,114.3 227.84,114.3 SV15.33 226.57,114.3 225.3,114.3 SV15.34
N$171
  Bottom 0.635: SV16.32 229.11,111.76 227.84,111.76 SV15.31 226.57,111.76 225.3,111.76 SV15.32
N$172
  Bottom 0.635: SV16.30 229.11,109.22 227.84,109.22 SV15.29 226.57,109.22 225.3,109.22 SV15.30
N$173
  Bottom 0.635: SV16.28 229.11,106.68 227.84,106.68 SV15.27 226.57,106.68 225.3,106.68 SV15.28
N$174
  Bottom 0.635: SV16.26 229.11,104.14 227.84,104.14 SV15.25 226.57,104.14 225.3,104.14 SV15.26
N$175
  Bottom 0.635: SV16.24 229.11,101.6 227.84,101.6 SV15.23 226.57,101.6 225.3,101.6 SV15.24
N$176
  Bottom 0.635: SV16.22 229.11,99.06 227.84,99.06 SV15.21 226.57,99.06 225.3,99.06 SV15.22
N$177
  Bottom 0.635: SV16.20 229.11,96.52 227.84,96.52 SV15.19 226.57,96.52 225.3,96.52 SV15.20
N$178
  Bottom 0.635: SV16.18 229.11,93.98 227.84,93.98 SV15.17 226.57,93.98 225.3,93.98 SV15.18
N$179
  Bottom 0.635: SV16.16 229.11,91.44 227.84,91.44 SV15.15 226.57,91.44 225.3,91.44 SV15.16
N$180
  Bottom 0.635: SV16.14 229.11,88.9 227.84,88.9 SV15.13 226.57,88.9 225.3,88.9 SV15.14
N$181
  Bottom 0.635: SV16.12 229.11,86.36 227.84,86.36 SV15.11 226.57,86.36 225.3,86.36 SV15.12
N$182
  Bottom 0.635: SV16.10 229.11,83.82 227.84,83.82 SV15.9 226.57,83.82 225.3,83.82 SV15.10
N$183
  Bottom 0.635: SV16.8 229.11,81.28 227.84,81.28 SV15.7 226.57,81.28 225.3,81.28 SV15.8
N$184
  Bottom 0.635: SV16.6 229.11,78.74 227.84,78.74 SV15.5 226.57,78.74 225.3,78.74 SV15.6
N$185
  Bottom 0.635: SV16.4 229.11,76.2 227.84,76.2 SV15.3 226.57,76.2 225.3,76.2 SV15.4
N$186
  Bottom 0.635: SV16.2 229.11,73.66 227.84,73.66 SV15.1 226.57,73.66 225.3,73.66 SV15.2
N$187
  Bottom 0.635: SV19.1 221.49,22.86 220.22,22.86 SV19.2 218.95,22.86 217.68,22.86 SV20.1
N$188
  Bottom 0.635: SV19.3 221.49,25.4 220.22,25.4 SV19.4 218.95,25.4 217.68,25.4 SV20.3
N$189
  Bottom 0.635: SV19.5 221.49,27.94 220.22,27.94 SV19.6 218.95,27.94 217.68,27.94 SV20.5
N$190
  Bottom 0.635: SV19.7 221.49,30.48 220.22,30.48 SV19.8 218.95,30.48 217.68,30.48 SV20.7
N$191
  Bottom 0.635: SV19.9 221.49,33.02 220.22,33.02 SV19.10 218.95,33.02 217.68,33.02 SV20.9
N$192
  Bottom 0.635: SV19.11 221.49,35.56 220.22,35.56 SV19.12 218.95,35.56 217.68,35.56 SV20.11
N$193
  Bottom 0.635: SV19.13 221.49,38.1 220.22,38.1 SV19.14 218.95,38.1 217.68,38.1 SV20.13
N$194
  Bottom 0.635: SV19.15 221.49,40.64 220.22,40.64 SV19.16 218.95,40.64 217.68,40.64 SV20.15
N$195
  Bottom 0.635: SV19.17 221.49,43.18 220.22,43.18 SV19.18 218.95,43.18 217.68,43.18 SV20.17
N$196
  Bottom 0.635: SV19.19 221.49,45.72 220.22,45.72 SV19.20 218.95,45.72 217.68,45.72 SV20.19
N$197
  Bottom 0.635: SV19.21 221.49,48.26 220.22,48.26 SV19.22 218.95,48.26 217.68,48.26 SV20.21
N$198
  Bottom 0.635: SV19.23 221.49,50.8 220.22,50.8 SV19.24 218.95,50.8 217.68,50.8 SV20.23
N$199
  Bottom 0.635: SV19.25 221.49,53.34 220.22,53.34 SV19.26 218.95,53.34 217.68,53.34 SV20.25
N$200
  Bottom 0.635: SV19.27 221.49,55.88 220.22,55.88 SV19.28 218.95,55.88 217.68,55.88 SV20.27
N$201
  Bottom 0.635: SV19.29 221.49,58.42 220.22,58.42 SV19.30 218.95,58.42 217.68,58.42 SV20.29
N$202
  Bottom 0.635: SV19.31 221.49,60.96 220.22,60.96 SV19.32 218.95,60.96 217.68,60.96 SV20.31
N$203
  Bottom 0.635: SV19.33 221.49,63.5 220.22,63.5 SV19.34 218.95,63.5 217.68,63.5 SV20.33
N$204
  Bottom 0.635: SV19.35 221.49,66.04 220.22,66.04 SV19.36 218.95,66.04 217.68,66.04 SV20.35
N$205
  Bottom 0.635: SV19.37 221.49,68.58 220.22,68.58 SV19.38 218.95,68.58 217.68,68.58 SV20.37
N$206
  Bottom 0.635: SV19.39 221.49,71.12 220.22,71.12 SV19.40 218.95,71.12 217.68,71.12 SV20.39
N$207
  Bottom 0.635: SV17.1 221.49,73.66 220.22,73.66 SV17.2 218.95,73.66 217.68,73.66 SV18.1
N$208
  Bottom 0.635: SV17.3 221.49,76.2 220.22,76.2 SV17.4 218.95,76.2 217.68,76.2 SV18.3
N$209
  Bottom 0.635: SV17.5 221.49,78.74 220.22,78.74 SV17.6 218.95,78.74 217.68,78.74 SV18.5
N$210
  Bottom 0.635: SV17.7 221.49,81.28 220.22,81.28 SV17.8 218.95,81.28 217.68,81.28 SV18.7
N$211
  Bottom 0.635: SV17.9 221.49,83.82 220.22,83.82 SV17.10 218.95,83.82 217.68,83.82 SV18.9
N$212
  Bottom 0.635: SV17.11 221.49,86.36 220.22,86.36 SV17.12 218.95,86.36 217.68,86.36 SV18.11
N$213
  Bottom 0.635: SV17.13 221.49,88.9 220.22,88.9 SV17.14 218.95,88.9 217.68,88.9 SV18.13
N$214
  Bottom 0.635: SV17.15 221.49,91.44 220.22,91.44 SV17.16 218.95,91.44 217.68,91.44 SV18.15
N$215
  Bottom 0.635: SV17.17 221.49,93.98 220.22,93.98 SV17.18 218.95,93.98 217.68,93.98 SV18.17
N$216
  Bottom 0.635: SV17.19 221.49,96.52 220.22,96.52 SV17.20 218.95,96.52 217.68,96.52 SV18.19
N$217
  Bottom 0.635: SV17.21 221.49,99.06 220.22,99.06 SV17.22 218.95,99.06 217.68,99.06 SV18.21
N$218
  Bottom 0.635: SV17.23 221.49,101.6 220.22,101.6 SV17.24 218.95,101.6 217.68,101.6 SV18.23
N$219
  Bottom 0.635: SV17.25 221.49,104.14 220.22,104.14 SV17.26 218.95,104.14 217.68,104.14 SV18.25
N$220
  Bottom 0.635: SV17.27 221.49,106.68 220.22,106.68 SV17.28 218.95,106.68 217.68,106.68 SV18.27
N$221
  Bottom 0.635: SV17.29 221.49,109.22 220.22,109.22 SV17.30 218.95,109.22 217.68,109.22 SV18.29
N$222
  Bottom 0.635: SV17.31 221.49,111.76 220.22,111.76 SV17.32 218.95,111.76 217.68,111.76 SV18.31
N$223
  Bottom 0.635: SV17.33 221.49,114.3 220.22,114.3 SV17.34 218.95,114.3 217.68,114.3 SV18.33
N$224
  Bottom 0.635: SV17.35 221.49,116.84 220.22,116.84 SV17.36 218.95,116.84 217.68,116.84 SV18.35
N$225
  Bottom 0.635: SV22.40 208.79,71.12 207.52,71.12 SV21.39 206.25,71.12 204.98,71.12 SV21.40
N$226
  Bottom 0.635: SV22.38 208.79,68.58 207.52,68.58 SV21.37 206.25,68.58 204.98,68.58 SV21.38
N$227
  Bottom 0.635: SV22.36 208.79,66.04 207.52,66.04 SV21.35 206.25,66.04 204.98,66.04 SV21.36
N$228
  Bottom 0.635: SV22.34 208.79,63.5 207.52,63.5 SV21.33 206.25,63.5 204.98,63.5 SV21.34
N$229
  Bottom 0.635: SV22.32 208.79,60.96 207.52,60.96 SV21.31 206.25,60.96 204.98,60.96 SV21.32
N$230
  Bottom 0.635: SV22.30 208.79,58.42 207.52,58.42 SV21.29 206.25,58.42 204.98,58.42 SV21.30
N$231
  Bottom 0.635: SV22.28 208.79,55.88 207.52,55.88 SV21.27 206.25,55.88 204.98,55.88 SV21.28
N$232
  Bottom 0.635: SV22.26 208.79,53.34 207.52,53.34 SV21.25 206.25,53.34 204.98,53.34 SV21.26
N$233
  Bottom 0.635: SV22.24 208.79,50.8 207.52,50.8 SV21.23 206.25,50.8 204.98,50.8 SV21.24
N$234
  Bottom 0.635: SV22.22 208.79,48.26 207.52,48.26 SV21.21 206.25,48.26 204.98,48.26 SV21.22
N$235
  Bottom 0.635: SV22.20 208.79,45.72 207.52,45.72 SV21.19 206.25,45.72 204.98,45.72 SV21.20
N$236
  Bottom 0.635: SV22.18 208.79,43.18 207.52,43.18 SV21.17 206.25,43.18 204.98,43.18 SV21.18
N$237
  Bottom 0.635: SV22.16 208.79,40.64 207.52,40.64 SV21.15 206.25,40.64 204.98,40.64 SV21.16
N$238
  Bottom 0.635: SV22.14 208.79,38.1 207.52,38.1 SV21.13 206.25,38.1 204.98,38.1 SV21.14
N$239
  Bottom 0.635: SV22.12 208.79,35.56 207.52,35.56 SV21.11 206.25,35.56 204.98,35.56 SV21.12
N$240
  Bottom 0.635: SV22.10 208.79,33.02 207.52,33.02 SV21.9 206.25,33.02 204.98,33.02 SV21.10
N$241
  Bottom 0.635: SV22.8 208.79,30.48 207.52,30.48 SV21.7 206.25,30.48 204.98,30.48 SV21.8
N$242
  Bottom 0.635: SV22.6 208.79,27.94 207.52,27.94 SV21.5 206.25,27.94 204.98,27.94 SV21.6
N$243
  Bottom 0.635: SV22.4 208.79,25.4 207.52,25.4 SV21.3 206.25,25.4 204.98,25.4 SV21.4
N$244
  Bottom 0.635: SV22.2 208.79,22.86 207.52,22.86 SV21.1 206.25,22.86 204.98,22.86 SV21.2
N$245
  Bottom 0.635: SV24.36 208.79,116.84 207.52,116.84 SV23.35 206.25,116.84 204.98,116.84 SV23.36
N$246
  Bottom 0.635: SV24.34 208.79,114.3 207.52,114.3 SV23.33 206.25,114.3 204.98,114.3 SV23.34
N$247
  Bottom 0.635: SV24.32 208.79,111.76 207.52,111.76 SV23.31 206.25,111.76 204.98,111.76 SV23.32
N$248
  Bottom 0.635: SV24.30 208.79,109.22 207.52,109.22 SV23.29 206.25,109.22 204.98,109.22 SV23.30
N$249
  Bottom 0.635: SV24.28 208.79,106.68 207.52,106.68 SV23.27 206.25,106.68 204.98,106.68 SV23.28
N$250
  Bottom 0.635: SV24.26 208.79,104.14 207.52,104.14 SV23.25 206.25,104.14 204.98,104.14 SV23.26
N$251
  Bottom 0.635: SV24.24 208.79,101.6 207.52,101.6 SV23.23 206.25,101.6 204.98,101.6 SV23.24
N$252
  Bottom 0.635: SV24.22 208.79,99.06 207.52,99.06 SV23.21 206.25,99.06 204.98,99.06 SV23.22
N$253
  Bottom 0.635: SV24.20 208.79,96.52 207.52,96.52 SV23.19 206.25,96.52 204.98,96.52 SV23.20
N$254
  Bottom 0.635: SV24.18 208.79,93.98 207.52,93.98 SV23.17 206.25,93.98 204.98,93.98 SV23.18
N$255
  Bottom 0.635: SV24.16 208.79,91.44 207.52,91.44 SV23.15 206.25,91.44 204.98,91.44 SV23.16
N$256
  Bottom 0.635: SV24.14 208.79,88.9 207.52,88.9 SV23.13 206.25,88.9 204.98,88.9 SV23.14
N$257
  Bottom 0.635: SV24.12 208.79,86.36 207.52,86.36 SV23.11 206.25,86.36 204.98,86.36 SV23.12
N$258
  Bottom 0.635: SV24.10 208.79,83.82 207.52,83.82 SV23.9 206.25,83.82 204.98,83.82 SV23.10
N$259
  Bottom 0.635: SV24.8 208.79,81.28 207.52,81.28 SV23.7 206.25,81.28 204.98,81.28 SV23.8
N$260
  Bottom 0.635: SV24.6 208.79,78.74 207.52,78.74 SV23.5 206.25,78.74 204.98,78.74 SV23.6
N$261
  Bottom 0.635: SV24.4 208.79,76.2 207.52,76.2 SV23.3 206.25,76.2 204.98,76.2 SV23.4
N$262
  Bottom 0.635: SV24.2 208.79,73.66 207.52,73.66 SV23.1 206.25,73.66 204.98,73.66 SV23.2
N$263
  Bottom 0.635: U$5.K2 164.97,15.24 165.61,14.61 B.K2
N$264
  Bottom 0.635: U$5.J2 168.15,15.24 168.78,14.61 B.J2
N$265
  Bottom 0.635: U$5.H2 171.32,15.24 171.96,14.61 B.H2
N$266
  Bottom 0.635: U$5.L2 161.8,15.24 162.43,14.61 B.L2
N$267
  Bottom 0.635: U$5.M2 158.62,15.24 159.26,14.61 B.M2
N$268
  Bottom 0.635: U$5.N2 155.45,15.24 156.08,14.61 B.N2
N$269
  Bottom 0.635: U$5.P2 152.27,15.24 152.91,14.61 B.P2
N$270
  Bottom 0.635: U$5.F2 174.5,15.24 175.13,14.61 B.F2
N$271
  Bottom 0.635: U$5.E2 177.67,15.24 178.31,14.61 B.E2
N$272
  Bottom 0.635: U$5.D2 180.85,15.24 181.48,14.61 B.D2
N$273
  Bottom 0.635: U$5.R2 149.1,15.24 149.73,14.61 B.R2
N$274
  Bottom 0.635: U$5.S2 145.92,15.24 146.56,14.61 B.S2
N$275
  Bottom 0.635: U$5.B2 187.2,15.24 187.83,14.61 B.B2
N$276
  Bottom 0.635: U$5.T2 142.75,15.24 143.38,14.61 B.T2
N$277
  Bottom 0.635: U$5.U2 139.57,19.68 139.57,17.14 140.21,16.51 140.21,13.97 B.U2
N$278  (via drill 0.81)
  Top 0.635: v138.94,15.88 138.94,18.41 137.03,20.32 U$5.V2
  Bottom 0.635: v138.94,15.88 137.03,13.97 B.V2
N$279
  Top 0.635: U$5.A1 191.64,17.14 191.64,13.97 B.A1
N$280
  Top 0.635: U$5.V1 137.67,17.14 137.67,13.97 B.V1
N$281
  Top 0.635: U$5.U1 140.84,17.14 140.84,13.97 B.U1
N$282
  Top 0.635: U$5.T1 144.02,15.24 B.T1
N$283
  Top 0.635: U$5.S1 147.19,15.24 B.S1
N$284
  Top 0.635: U$5.R1 150.37,15.24 B.R1
N$285
  Top 0.635: U$5.P1 153.54,15.24 B.P1
N$286
  Top 0.635: U$5.N1 156.72,15.24 B.N1
N$287
  Top 0.635: U$5.M1 159.89,15.24 B.M1
N$288
  Top 0.635: U$5.L1 163.07,15.24 B.L1
N$289
  Top 0.635: U$5.K1 166.24,15.24 B.K1
N$290
  Top 0.635: U$5.J1 169.42,15.24 B.J1
N$291
  Top 0.635: U$5.H1 172.59,15.24 B.H1
N$292
  Top 0.635: U$5.F1 175.77,15.24 B.F1
N$293
  Top 0.635: U$5.E1 178.94,15.24 B.E1
N$294
  Top 0.635: U$5.D1 182.12,15.24 B.D1
N$295
  Top 0.635: U$5.C1 185.29,15.24 B.C1
N$296
  Top 0.635: U$5.B1 188.47,15.24 B.B1
N$297
  Bottom 0.635: SV27.1 152.91,22.86 151.64,22.86 SV27.2 150.37,22.86 149.1,22.86 SV28.1
N$298
  Bottom 0.635: SV27.3 152.91,25.4 151.64,25.4 SV27.4 150.37,25.4 149.1,25.4 SV28.3
N$299
  Bottom 0.635: SV27.5 152.91,27.94 151.64,27.94 SV27.6 150.37,27.94 149.1,27.94 SV28.5
N$300
  Bottom 0.635: SV27.7 152.91,30.48 151.64,30.48 SV27.8 150.37,30.48 149.1,30.48 SV28.7
N$301
  Bottom 0.635: SV27.9 152.91,33.02 151.64,33.02 SV27.10 150.37,33.02 149.1,33.02 SV28.9
N$302
  Bottom 0.635: SV27.11 152.91,35.56 151.64,35.56 SV27.12 150.37,35.56 149.1,35.56 SV28.11
N$303
  Bottom 0.635: SV27.13 152.91,38.1 151.64,38.1 SV27.14 150.37,38.1 149.1,38.1 SV28.13
N$304
  Bottom 0.635: SV27.15 152.91,40.64 151.64,40.64 SV27.16 150.37,40.64 149.1,40.64 SV28.15
N$305
  Bottom 0.635: SV27.17 152.91,43.18 151.64,43.18 SV27.18 150.37,43.18 149.1,43.18 SV28.17
N$306
  Bottom 0.635: SV27.19 152.91,45.72 151.64,45.72 SV27.20 150.37,45.72 149.1,45.72 SV28.19
N$307
  Bottom 0.635: SV27.21 152.91,48.26 151.64,48.26 SV27.22 150.37,48.26 149.1,48.26 SV28.21
N$308
  Bottom 0.635: SV27.23 152.91,50.8 151.64,50.8 SV27.24 150.37,50.8 149.1,50.8 SV28.23
N$309
  Bottom 0.635: SV27.25 152.91,53.34 151.64,53.34 SV27.26 150.37,53.34 149.1,53.34 SV28.25
N$310
  Bottom 0.635: SV27.27 152.91,55.88 151.64,55.88 SV27.28 150.37,55.88 149.1,55.88 SV28.27
N$311
  Bottom 0.635: SV27.29 152.91,58.42 151.64,58.42 SV27.30 150.37,58.42 149.1,58.42 SV28.29
N$312
  Bottom 0.635: SV27.31 152.91,60.96 151.64,60.96 SV27.32 150.37,60.96 149.1,60.96 SV28.31
N$313